# Altium schematic sheet Linear_actuator.SchDoc
size A
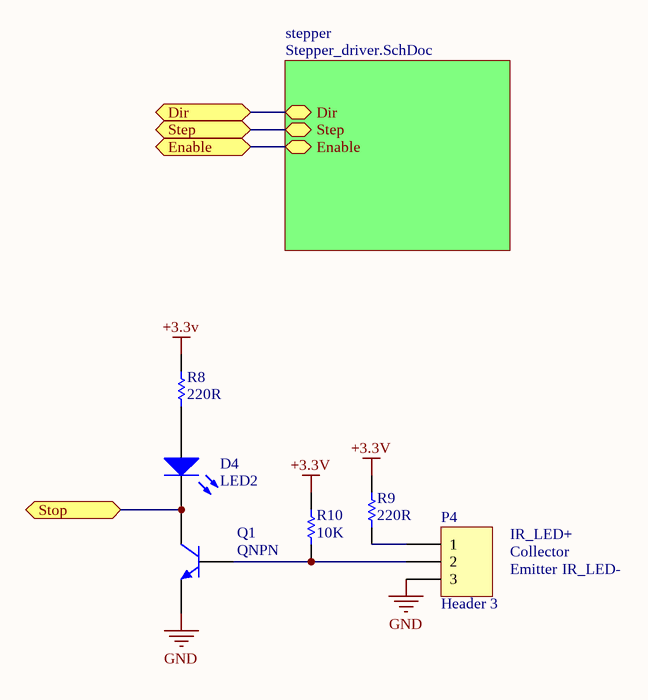
[diagram p0: Linear_actuator.SchDoc]

## Parts
D4  LED2  [LED 0805]
P4  Header 3  [HDR1X3]
Q1  QNPN  [SOT-23B_N]
R8  value 220R  [J1-0603]  (hidden comment: Res)
R9  value 220R  [J1-0603]  (hidden comment: Res)
R10  value 10K  [J1-0603]  (hidden comment: Res)

## Sub-sheets
stepper = Stepper_driver.SchDoc: Dir, Step, Enable

## Ports
Dir, Enable, Step, Stop

## Nets
+3.3V: R8.2 R9.2 R10.2
GND: P4.3 Q1.3(E)
Dir: port Dir, sheet stepper/Dir
Enable: port Enable, sheet stepper/Enable
Step: port Step, sheet stepper/Step
Stop: D4.2(K) Q1.1(C) ; port Stop
NetD4_1: D4.1(A) R8.1
NetP4_1: P4.1 R9.1
NetP4_2: P4.2 Q1.2(B) R10.1

## Notes on the sheet
- IR_LED+
- Collector
- Emitter
- IR_LED-

## Library data of the parts
D4 = LED2: Typical RED, GREEN, YELLOW, AMBER GaAs LED; Published: 8-Jun-2000; LatestRevisionDate: 17-Jul-2002; LatestRevisionNote: Re-released for DXP Platform.; PackageVersion: Feb-2002; PackageReference: 3.2X1.6X1.1; Publisher: Altium Limited; PackageDescription: SM LED; 2 Flat Leads
P4 = Header 3: Header, 3-Pin; LatestRevisionDate: 17-Jul-2002; LatestRevisionNote: Re-released for DXP Platform.; Publisher: Altium Limited
Q1 = QNPN: NPN Bipolar Transistor; Published: 8-Jun-2000; LatestRevisionDate: 29-May-2009; LatestRevisionNote: IPC-7351 Footprint Added.; PackageVersion: Aug-1999; PackageReference: SOT-23B; Publisher: Altium Limited; PackageDescription: 3-Pin SOT-23 Package 0.95 mm Pitch, 2.4 mm Lead Span
R8-R10 = Res: Resistor 0805; Published: 8-Jun-2000; LatestRevisionDate: 17-Jul-2002; LatestRevisionNote: Re-released for DXP Platform.; PackageReference: AXIAL-0.3; Publisher: Altium Limited; PackageDescription: Axial Device, Thru-Hole; 2 Leads; 0.3 in Pin Spacing